# EAGLE design board (EAGLE 9.6.2)
CDESIGNER: Kihun Song; CNAME: 4-port-USB-hub; CREVISION: V1.0.0
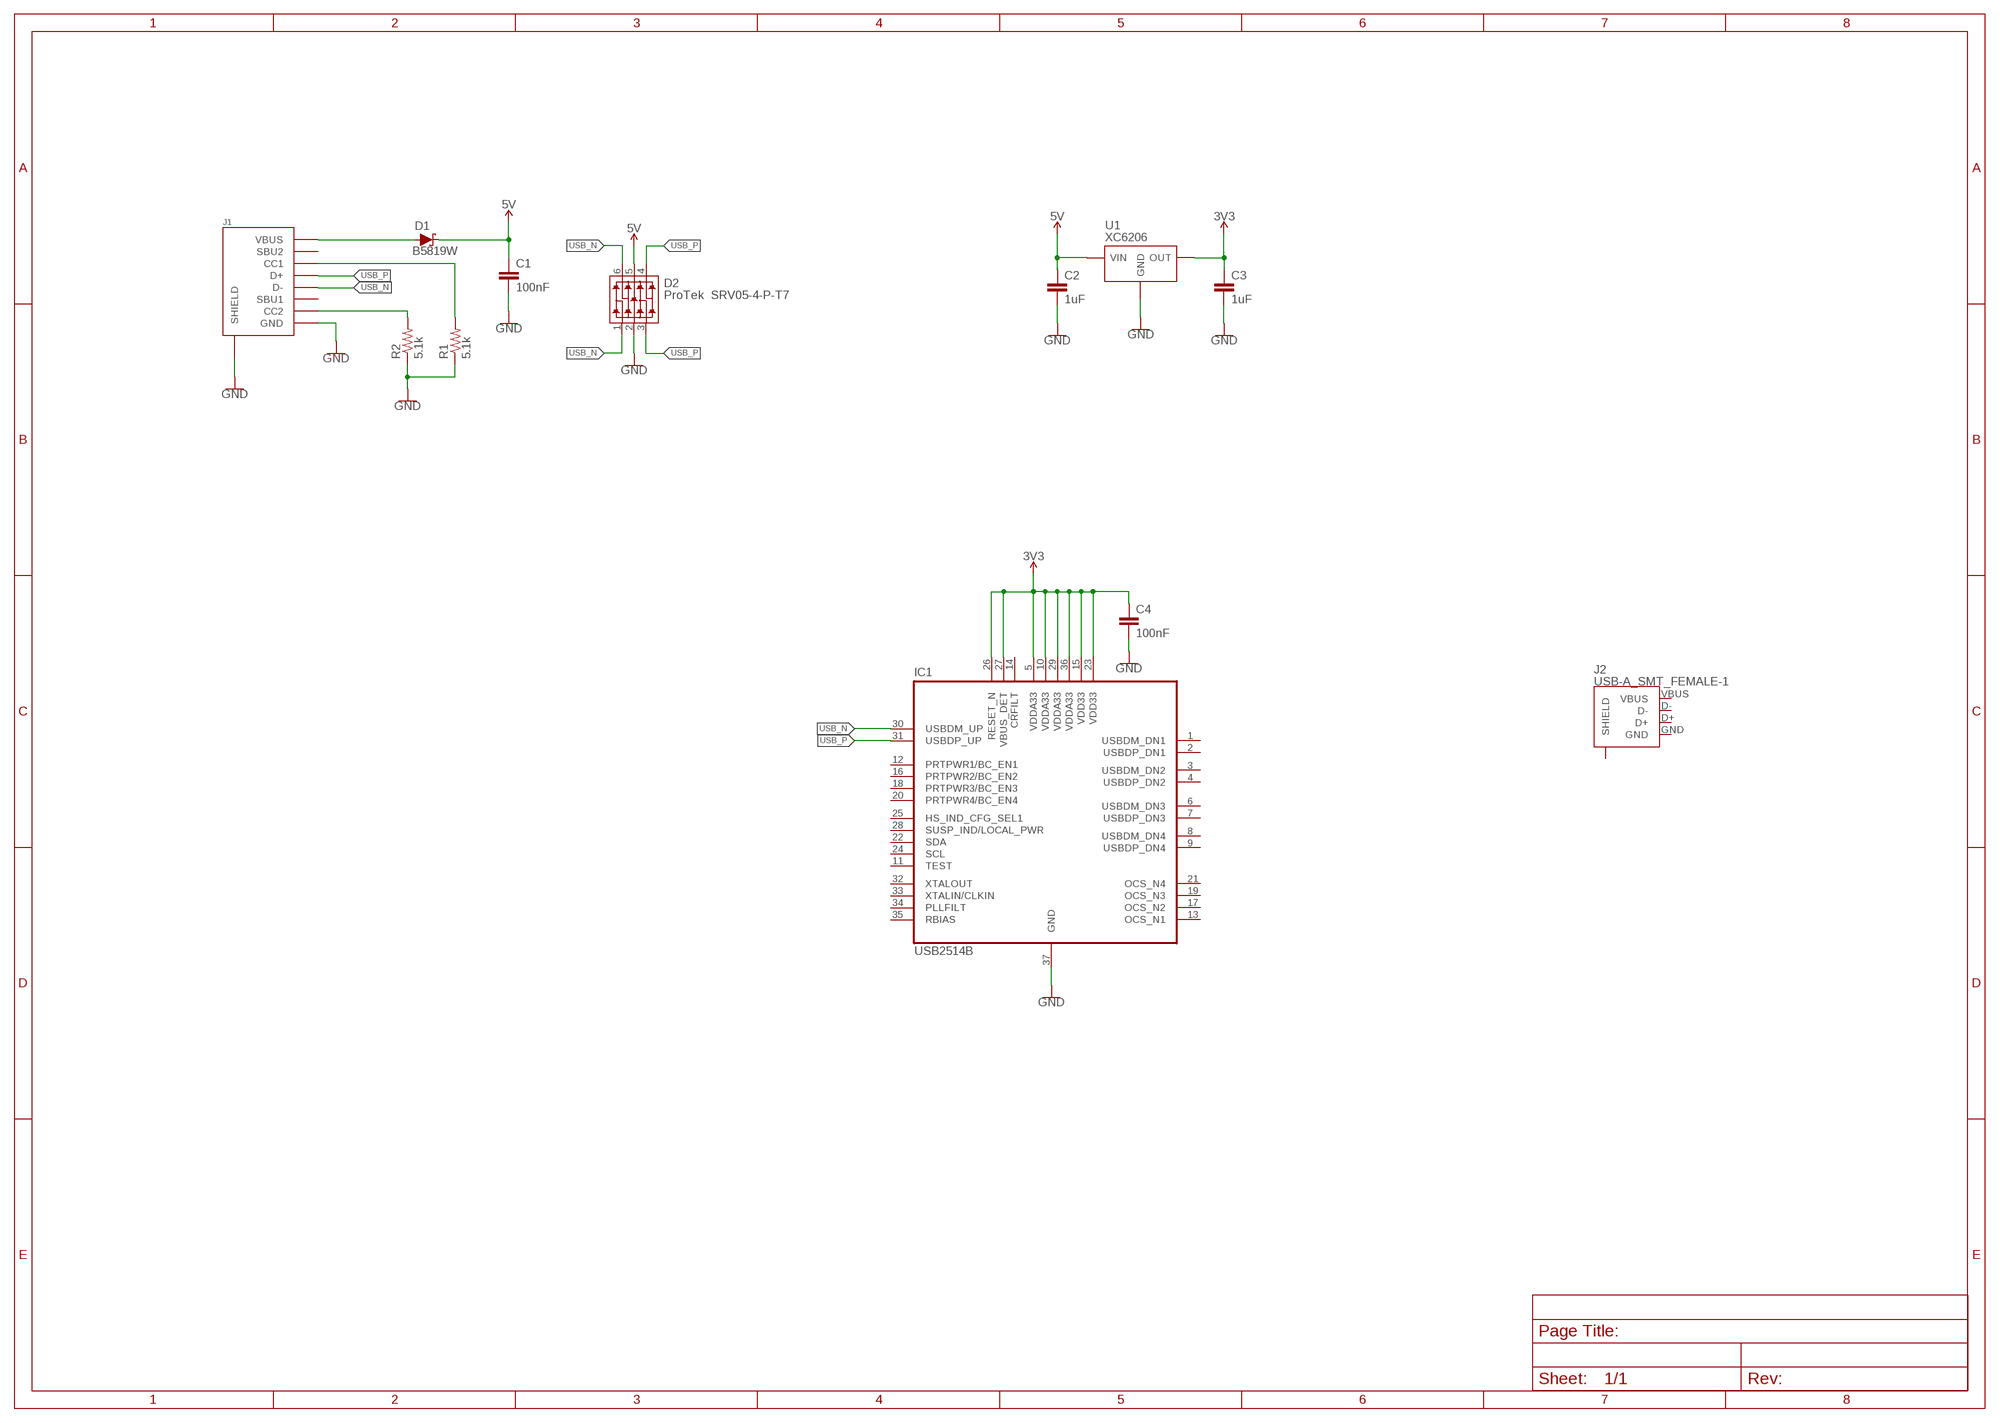
[diagram p0: schematic, sheet 1]

## Parts
C1  100nF  C-NON-POLC0402  [C0402]
C2  1uF  C-NON-POLC0402  [C0402]
C3  1uF  C-NON-POLC0402  [C0402]
C4  100nF  C-NON-POLC0402  [C0402]
D1  B5819W  DIODE-SCHOTTKY_SOD-123  [SOD-123]
D2  ProTek SRV05-4-P-T7  TVS-ARRAY_SOT-23-6  [SPT-23-6]
IC1  USB2514B  [QFN50P600X600X100-37T370N]
J1  USB-TYPE-C-31-M-12  [USB-TYPE-C-31-M-12]
J2  USB-A_SMT_FEMALE-1  [USB-A-FEMALE-2]
R1  5.1k  RR0402  [R0402]
R2  5.1k  RR0402  [R0402]
U1  XC6206  [SOT-23-3L]

## Nets
3V3 [Power]: C3.1 C4.1 IC1.5(VDDA33) IC1.10(VDDA33) IC1.15(VDD33) IC1.23(VDD33) IC1.26(RESET_N) IC1.27(VBUS_DET) IC1.29(VDDA33) IC1.36(VDDA33) U1.2(OUT)
5V [Power]: C1.1 C2.1 D1.C D2.5(VCC) U1.3(VIN)
5V_IN [Power]: D1.A J1.VBUS1(VBUS) J1.VBUS2(VBUS)
GND [Power]: C1.2 C2.2 C3.2 C4.2 D2.2(VSS) IC1.37(GND) J1.GND1(GND) J1.GND2(GND) J1.SHLD-B1(SHIELD) J1.SHLD-B2(SHIELD) J1.SHLD-B3(SHIELD) J1.SHLD-B4(SHIELD) J1.SHLD-T1(SHIELD) J1.SHLD-T2(SHIELD) J1.SHLD-T3(SHIELD) J1.SHLD-T4(SHIELD) R1.1 R2.1 U1.1(GND)
N$3: J1.A5(CC1) R1.2
N$4: J1.B5(CC2) R2.2
USB_N [USB]: D2.1(IO1) D2.6(IO4) IC1.30(USBDM_UP) J1.A7(D-) J1.B7(D-)
USB_P [USB]: D2.3(IO2) D2.4(IO3) IC1.31(USBDP_UP) J1.A6(D+) J1.B6(D+)
Unconnected: IC1.1(USBDM_DN1) IC1.2(USBDP_DN1) IC1.3(USBDM_DN2) IC1.4(USBDP_DN2) IC1.6(USBDM_DN3) IC1.7(USBDP_DN3) IC1.8(USBDM_DN4) IC1.9(USBDP_DN4) IC1.11(TEST) IC1.12(PRTPWR1/BC_EN1) IC1.13(OCS_N1) IC1.14(CRFILT) IC1.16(PRTPWR2/BC_EN2) IC1.17(OCS_N2) IC1.18(PRTPWR3/BC_EN3) IC1.19(OCS_N3) IC1.20(PRTPWR4/BC_EN4) IC1.21(OCS_N4) IC1.22(SDA) IC1.24(SCL) IC1.25(HS_IND_CFG_SEL1) IC1.28(SUSP_IND/LOCAL_PWR) IC1.32(XTALOUT) IC1.33(XTALIN/CLKIN) IC1.34(PLLFILT) IC1.35(RBIAS) J1.A8(SBU1) J1.B8(SBU2) J2.D+ J2.D- J2.SHIELD@0(SHIELD) J2.SHIELD@1(SHIELD)

## Power pins joined to a net without a drawn wire
GND: J2.GND
VBUS: J2.VBUS

## Library data of the parts
C1 C4 = angrypig7-RCL:C-NON-POL; LCSC: C1525; SPICEPREFIX: C
C2 C3 = angrypig7-RCL:C-NON-POL; LCSC: C52923; SPICEPREFIX: C
D1 = angrypig7-Diodes:DIODE-SCHOTTKY; LCSC: C8598
D2 = angrypig7-Diodes:TVS-ARRAY; LCSC: C85364
IC1 = angrypig7-IC:USB2514B
J1 = angrypig7-Connectors-USB:USB-TYPE-C-31-M-12; LCSC: C165948
J2 = angrypig7-Connectors-USB:USB-A
R1 R2 = angrypig7-RCL:R; LCSC: C25905; SPICEPREFIX: R
U1 = angrypig7-IC-Power:XC6206: LDO; LCSC: C5446

## Net classes
0 default: width 0.203 mm
1 Power: width 0.406 mm

## Board
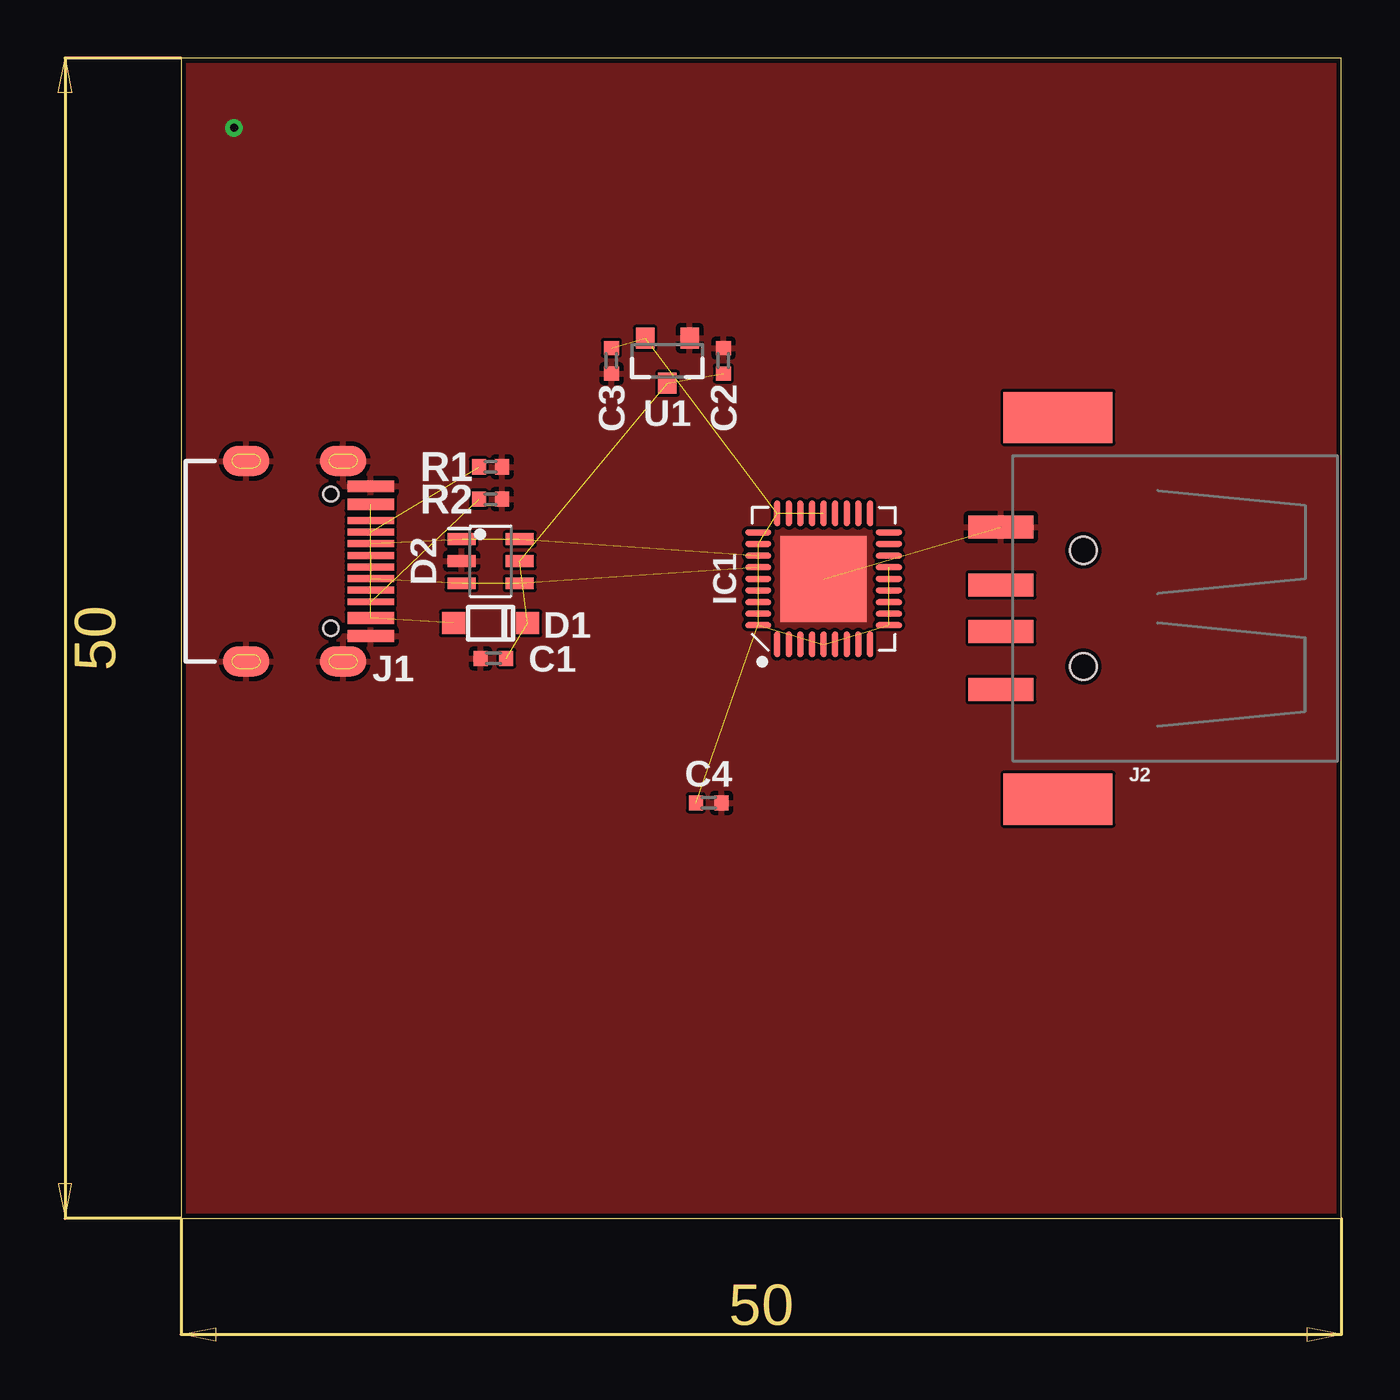
[diagram p1: board, top side]
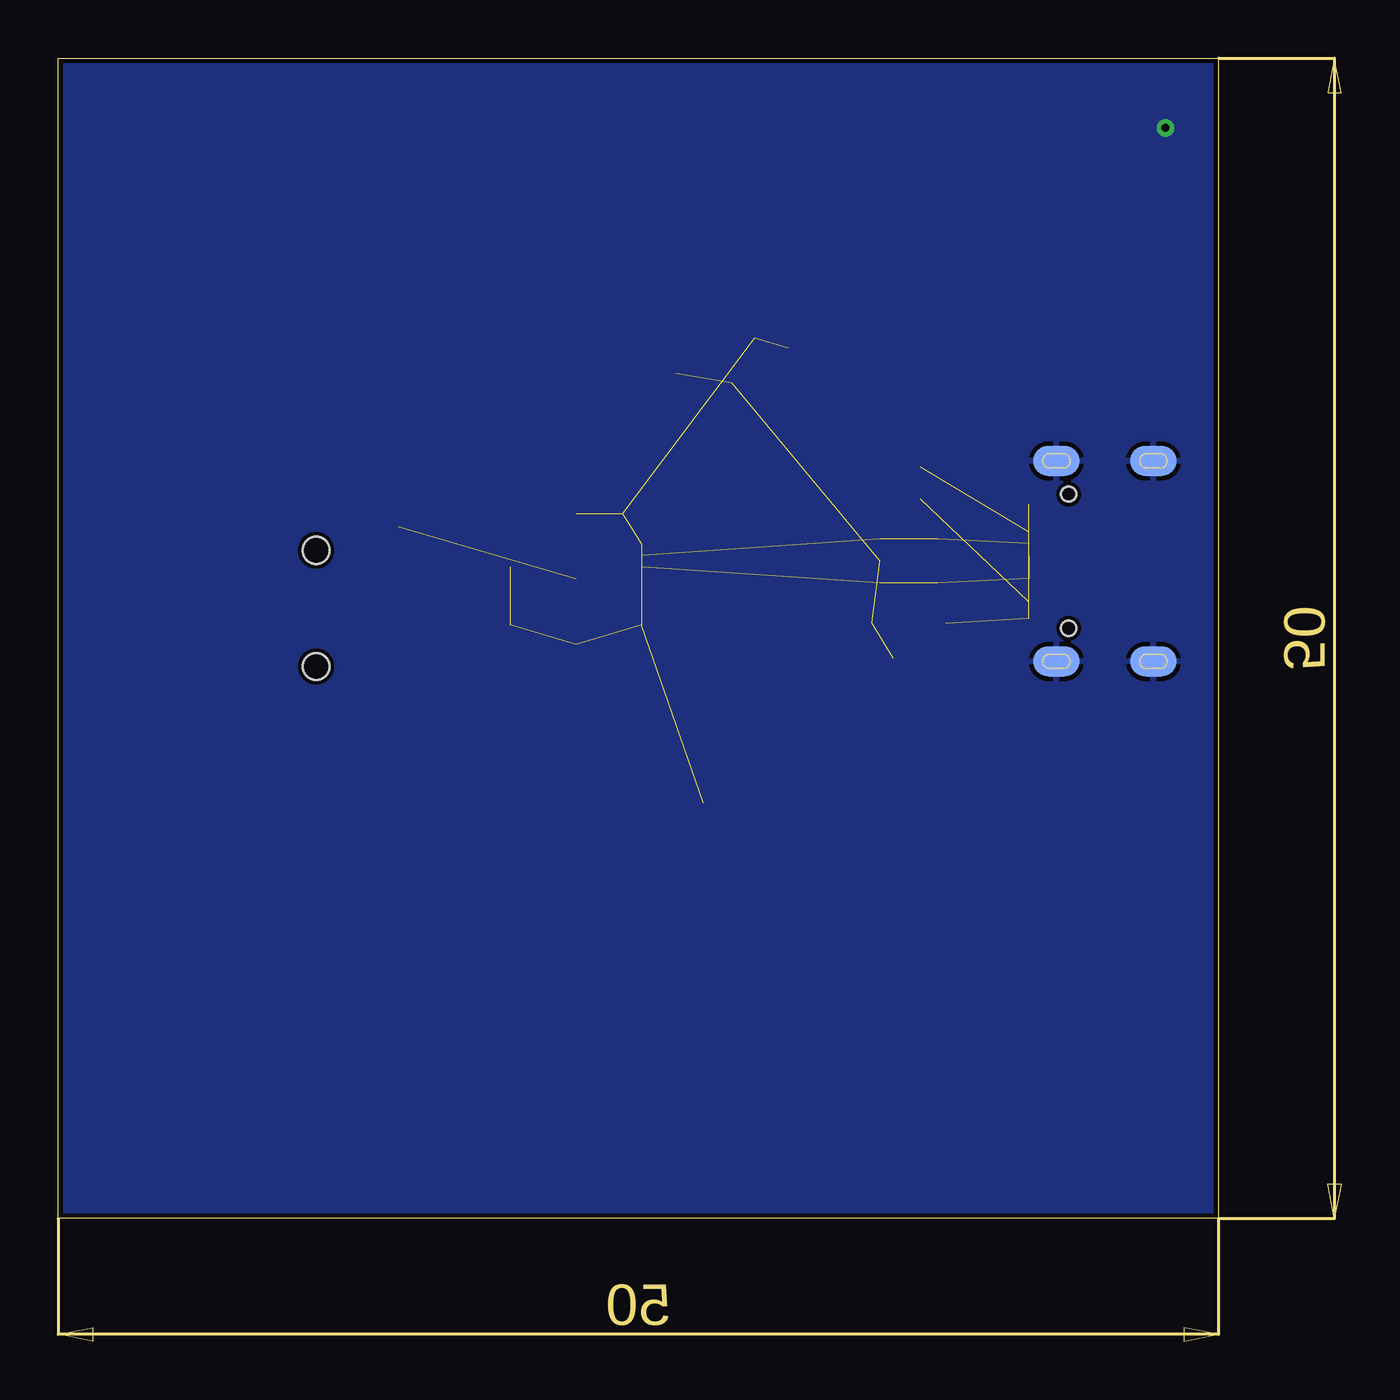
[diagram p2: board, bottom side, seen from below]

Size 50 x 50 mm. Coordinates in mm from the lower left corner, seen from the top.
Outline: 0,0 50,0 50,50 0,50 0,0
Copper layers (1*16): Top 0.035mm / dielectric 1.5mm / Bottom 0.035mm
Design rules "JLCPCB_2-Layer - safe": minimum track width 0.13208125mm, minimum drill 0.2mm, track to track 0.13208125mm, track to pad 0.13208125mm, pad to pad 0.13208125mm, via to via 0.13208125mm, smd to smd 0.13208125mm, copper to edge 8mil, drill to drill 3mil, minimum pad ring 3mil, minimum via ring 0.2mm, stop-mask expansion 4mil, vias tented up to drill 15mil, thermal gap 8mil

### Footprints (pad centres in the part's own frame; a part is rotated, then mirrored left to right if it is on the bottom)
C0402 = smd 0.6 x 0.65: 1 -0.551,0; 2 0.551,0
SOD-123 = smd 0.988 x 0.95: A 1.6,0; C -1.6,0
SPT-23-6 = smd 1.209 x 0.51: 1 -1.253,0.95; 2 -1.253,0; 3 -1.253,-0.95; 4 1.253,-0.95; 5 1.253,0; 6 1.253,0.95
QFN50P600X600X100-37T370N = smd 1.133 x 0.264: 1 -2.819,2; 2 -2.819,1.5; 3 -2.819,1; 4 -2.819,0.5; 5 -2.819,0; 6 -2.819,-0.5; 7 -2.819,-1; 8 -2.819,-1.5; 9 -2.819,-2; 19 2.819,-2; 20 2.819,-1.5; 21 2.819,-1; 22 2.819,-0.5; 23 2.819,0; 24 2.819,0.5; 25 2.819,1; 26 2.819,1.5; 27 2.819,2 | smd 0.264 x 1.133: 10 -2,-2.819; 11 -1.5,-2.819; 12 -1,-2.819; 13 -0.5,-2.819; 14 0,-2.819; 15 0.5,-2.819; 16 1,-2.819; 17 1.5,-2.819; 18 2,-2.819; 28 2,2.819; 29 1.5,2.819; 30 1,2.819; 31 0.5,2.819; 32 0,2.819; 33 -0.5,2.819; 34 -1,2.819; 35 -1.5,2.819; 36 -2,2.819 | smd 3.7 x 3.7: 37 0,0
USB-TYPE-C-31-M-12 = smd 0.3 x 2: A5 -1.25,1.19; A6 -0.25,1.19; A7 0.25,1.19; A8 1.25,1.19; B5 1.75,1.19; B6 0.75,1.19; B7 -0.75,1.19; B8 -1.75,1.19 | smd 0.5 x 2: GND1 -3.225,1.19; GND2 3.225,1.19; VBUS1 -2.45,1.19; VBUS2 2.45,1.19 | smd 1.3 x 2 bottom: SHLD-B1 -4.32,0; SHLD-B2 4.32,0; SHLD-B3 -4.32,-4.18; SHLD-B4 4.32,-4.18 | smd 1.3 x 2: SHLD-T1 -4.32,0; SHLD-T2 4.32,0; SHLD-T3 -4.32,-4.18; SHLD-T4 4.32,-4.18 | hole 0.65: -2.89,-0.53; 2.89,-0.53
USB-A-FEMALE-2 = smd 2.8 x 1: D+ 0.1,-1; D- 0.1,1; GND 0.1,-3.5; VBUS 0.1,3.5 | smd 4.7 x 2.2: SHIELD@0 -2.35,8.225; SHIELD@1 -2.35,-8.225 | hole 1.15: -3.45,2.5; -3.45,-2.5
R0402 = smd 0.6 x 0.65: 1 -0.5,0; 2 0.5,0
SOT-23-3L = smd 0.9 x 0.8: 1 0.97,-0.96; 2 0.97,0.96; 3 -0.97,0

### Placement (x,y rotation side)
C1  13.46,24.13 180 top
C2  23.37,36.96 90 top
C3  18.54,36.96 270 top
C4  22.73,17.91 0 top
D1  13.34,25.65 180 top
D2  13.34,28.32 0 top
IC1  27.69,27.56 90 top
J1  6.99,28.32 270 top
J2  35.43,26.29 180 top
R1  13.34,32.38 180 top
R2  13.34,30.99 180 top
U1  20.95,36.96 90 top

### Tracks (layer width: path | path; a pad name or v marks a point on that pad's centre or on a via)
3V3  (10 unrouted)
5V  (4 unrouted)
5V_IN  (2 unrouted)
GND  (via drill 0.35)  (1 unrouted)
  other vias: 2.29,46.99
  pour Top: 0,50 50,50 50,0 0,0
  pour Bottom: 0,50 50,50 50,0 0,0
N$3  (1 unrouted)
N$4  (1 unrouted)
USB_N  (4 unrouted)
USB_P  (4 unrouted)